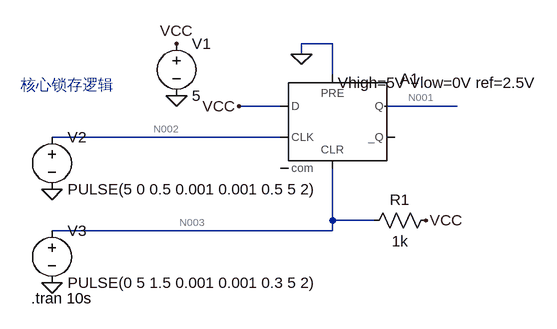
[diagram p0: schematic lock.asc]
lock.asc, the LTspice schematic file:
Version 4.1
SHEET 1 880 680
WIRE 160 48 112 48
WIRE 112 64 112 48
WIRE 160 96 160 48
WIRE 80 144 16 144
WIRE 352 144 240 144
WIRE 80 192 -272 192
WIRE 160 320 160 240
WIRE 224 320 160 320
WIRE 160 336 160 320
WIRE 160 336 -272 336
FLAG -80 48 VCC
FLAG 16 144 VCC
FLAG -80 128 0
FLAG -272 272 0
FLAG -272 416 0
FLAG 112 64 0
FLAG 304 320 VCC
SYMBOL Digital\\dflop 160 96 R0
WINDOW 3 8 12 Left 2
SYMATTR Value Vhigh=5V Vlow=0V ref=2.5V
SYMATTR InstName A1
SYMBOL voltage -80 32 R0
WINDOW 123 0 0 Left 0
WINDOW 39 0 0 Left 0
SYMATTR InstName V1
SYMATTR Value 5
SYMBOL voltage -272 176 R0
WINDOW 123 0 0 Left 0
WINDOW 39 0 0 Left 0
SYMATTR InstName V2
SYMATTR Value PULSE(5 0 0.5 0.001 0.001 0.5 5 2)
SYMBOL voltage -272 320 R0
WINDOW 123 0 0 Left 0
WINDOW 39 0 0 Left 0
SYMATTR InstName V3
SYMATTR Value PULSE(0 5 1.5 0.001 0.001 0.3 5 2)
SYMBOL res 320 304 R90
WINDOW 0 0 56 VBottom 2
WINDOW 3 32 56 VTop 2
SYMATTR InstName R1
SYMATTR Value 1k
TEXT -304 440 Left 2 !.tran 10s
TEXT -320 112 Left 2 ;核心锁存逻辑

The netlist it stands for:
* lock.asc
A1 VCC 0 N002 0 N003 0 N001 0 DFLOP Vhigh=5V Vlow=0V ref=2.5V
V1 VCC 0 5
V2 N002 0 PULSE(5 0 0.5 0.001 0.001 0.5 5 2)
V3 N003 0 PULSE(0 5 1.5 0.001 0.001 0.3 5 2)
R1 VCC N003 1k
.tran 10s
* 核心锁存逻辑
.backanno
.end

* Results of the author's LTspice run, read from the files saved beside the schematic
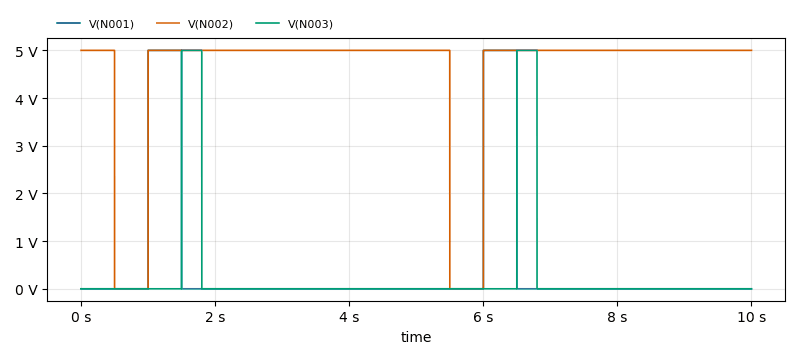
[diagram p1: Transient Analysis of lock.asc, plotted from the saved traces]
* Transient Analysis, 1 run:
*   V(N001): min 0 V, max 5 V, average 499 mV, rms 1.58 V, last 0 V
*   V(N002): min 0 V, max 5 V, average 4.499 V, rms 4.743 V, last 5 V
*   V(N003): min 0 V, max 5 V, average 301 mV, rms 1.227 V, last 0 V